# Altium schematic sheet Main.SchDoc
size A; SheetNumber: 1; SheetTotal: 4
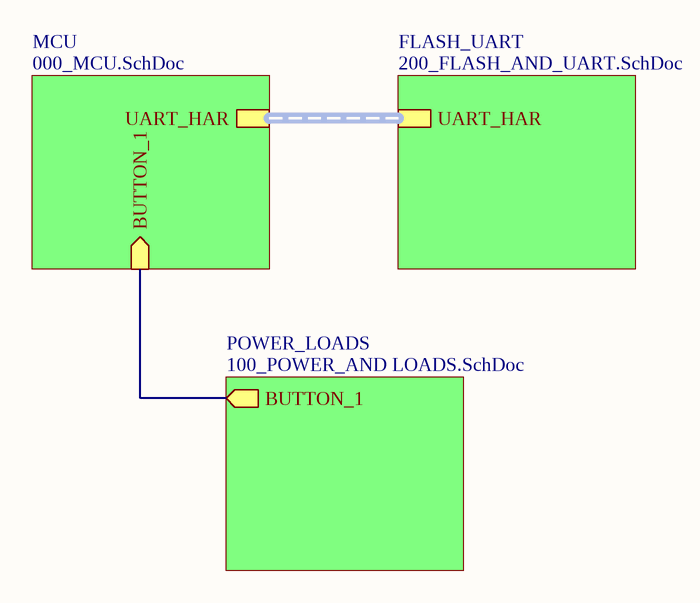
[diagram p0: Main.SchDoc]

## Sub-sheets
FLASH_UART = 200_FLASH_AND_UART.SchDoc: UART_HAR (harness UART_HAR)
MCU = 000_MCU.SchDoc: UART_HAR (harness UART_HAR), BUTTON_1 (in)
POWER_LOADS = 100_POWER_AND LOADS.SchDoc: BUTTON_1 (out)

## Nets
(unnamed): sheet MCU/BUTTON_1, sheet POWER_LOADS/BUTTON_1

## Buses and harness runs
harness sheet FLASH_UART/UART_HAR = sheet MCU/UART_HAR